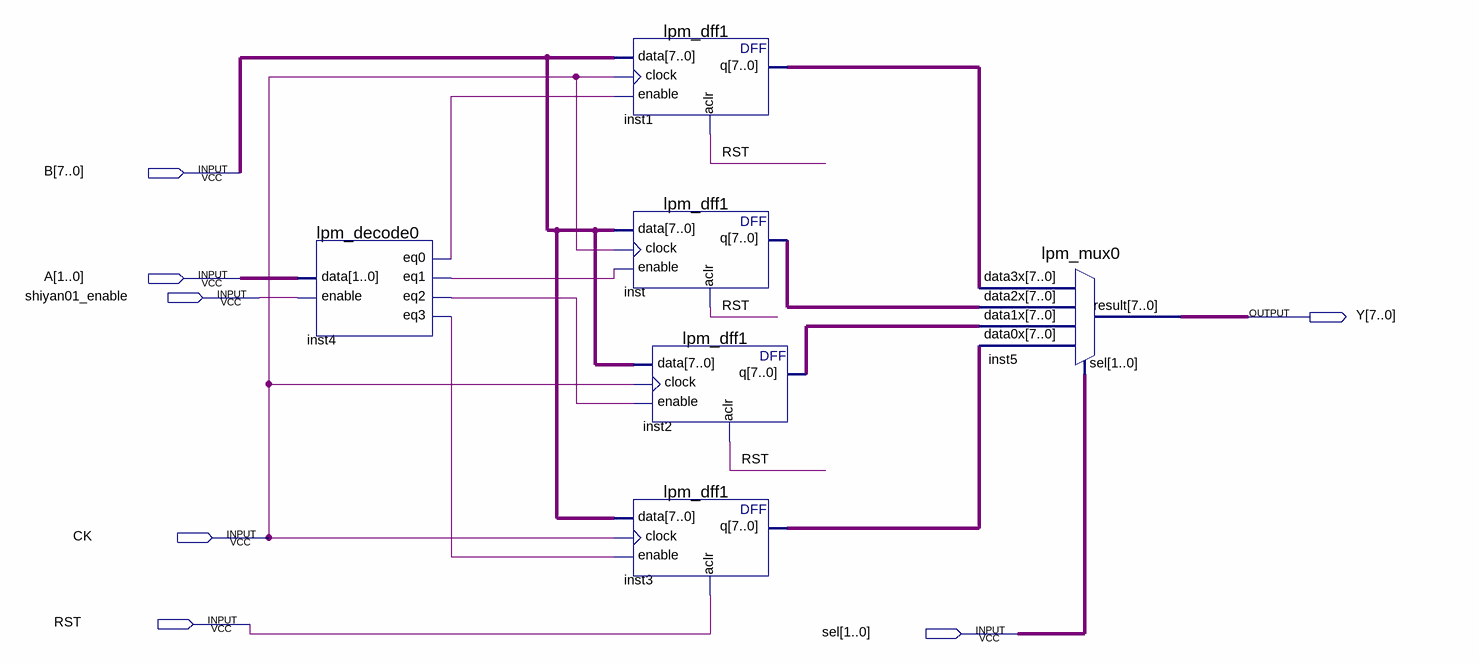
[diagram p0: schematic sheet]
// Quartus schematic test202101.bdf as structural Verilog: 6 symbols, 7 pins
module test202101 (
  input  [7:0] B,
  input  [1:0] A,
  input  shiyan01_enable,
  input  CK,
  input  RST,
  input  [1:0] sel,
  output [7:0] Y
);

  wire inst4_eq0, inst4_eq1, inst4_eq2, inst4_eq3;
  wire [7:0] inst1_q, inst2_q, inst3_q, inst_q;

  lpm_decode0 inst4 (
    .data(A), .enable(shiyan01_enable), .eq0(inst4_eq0), .eq1(inst4_eq1), .eq2(inst4_eq2), .eq3(inst4_eq3));
  lpm_dff1 inst1 (.data(B), .clock(CK), .enable(inst4_eq0), .aclr(RST), .q(inst1_q));
  lpm_dff1 inst (.data(B), .clock(CK), .enable(inst4_eq1), .aclr(RST), .q(inst_q));
  lpm_dff1 inst2 (.data(B), .clock(CK), .enable(inst4_eq2), .aclr(RST), .q(inst2_q));
  lpm_dff1 inst3 (.data(B), .clock(CK), .enable(inst4_eq3), .aclr(RST), .q(inst3_q));
  lpm_mux0 inst5 (.data3x(inst1_q), .data2x(inst_q), .data1x(inst2_q), .data0x(inst3_q), .sel(sel), .result(Y));
endmodule
